# Altium schematic sheet AD8368.SchDoc
size A2; SheetNumber: 1; SheetTotal: 1
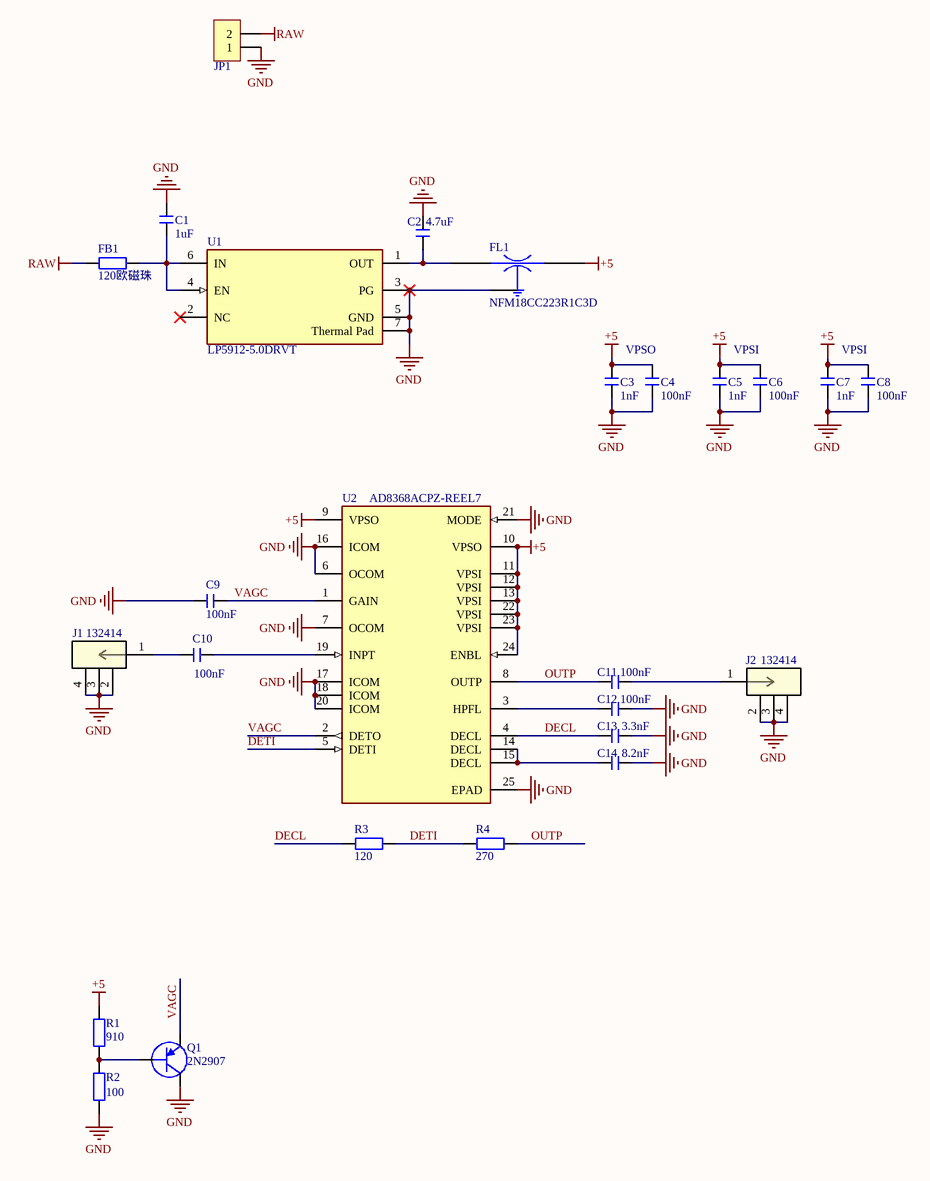
[diagram p0: AD8368.SchDoc]

## Parts
C1  1uF  [C 0603_L]
C2  4.7uF  [C 0603_L]
C3  1nF  [C 0402_L]
C4  100nF  [C 0402_L]
C5  1nF  [C 0402_L]
C6  100nF  [C 0402_L]
C7  1nF  [C 0402_L]
C8  100nF  [C 0402_L]
C9  100nF  [C 0402_L]
C10  100nF  [C 0402_L]
C11  100nF  [C 0402_L]
C12  100nF  [C 0402_L]
C13  3.3nF  [C 0402_L]
C14  8.2nF  [C 0402_L]
FB1  120欧磁珠  [R 0603_L]
FL1  NFM18CC223R1C3D  [FIL_NFM18CC223R1C3D]
J1  132414  [CONN_132414_AMP]
J2  132414  [CONN_132414_AMP]
JP1  HDR-1X2  [KF2510-LI-2P]  (value not drawn)
Q1  2N2907  [SOT23-3N]
R1  910  [R 0402_L]
R2  100  [R 0402_L]
R3  120  [R 0603_L]
R4  270  [R 0603_L]
U1  LP5912-5.0DRVT  [FP-DRV0006A-MFG]
U2  AD8368ACPZ-REEL7  [FP-CP-24-7-IPC_C]

## Nets
+5: C3.2 C4.2 C5.2 C6.2 C7.2 C8.2 FL1.3 R1.2 U2.9(VPSO) U2.10(VPSO) U2.11(VPSI) U2.12(VPSI) U2.13(VPSI) U2.22(VPSI) U2.23(VPSI) U2.24(ENBL)
GND: C1.2 C2.2 C3.1 C4.1 C5.1 C6.1 C7.1 C8.1 C9.1 C12.2 C13.2 C14.2 FL1.2(GND) J1.2 J1.3 J1.4 J2.2 J2.3 J2.4 JP1.1 Q1.3(C) R2.1 U1.3(PG) U1.5(GND) U1.7(Thermal_Pad) U2.6(OCOM) U2.7(OCOM) U2.16(ICOM) U2.17(ICOM) U2.18(ICOM) U2.20(ICOM) U2.21(MODE) U2.25(EPAD)
RAW: FB1.1 JP1.2
DECL: C13.1 R3.1 U2.4(DECL)
DETI: R3.2 R4.1 U2.5(DETI)
OUTP: C11.1 R4.2 U2.8(OUTP)
VAGC: C9.2 Q1.1(E) U2.1(GAIN) U2.2(DETO)
NetC1_1: C1.1 FB1.2 U1.4(EN) U1.6(IN)
NetC2_1: C2.1 FL1.1 U1.1(OUT)
NetC10_1: C10.1 J1.1
NetC10_2: C10.2 U2.19(INPT)
NetC11_2: C11.2 J2.1
NetC12_1: C12.1 U2.3(HPFL)
NetC14_1: C14.1 U2.14(DECL) U2.15(DECL)
NetQ1_2: Q1.2(B) R1.1 R2.2

Not connected (* = marked no-connect by the designer): U1 2(NC)*

## Notes on the sheet
- VPSO
- VPSI

## Library data of the parts
C1-C14 = C: 贴片电容; 淘宝ID: 小糖豆的小窝窝; BOM名称: 贴片电容; 下单链接: https://item.taobao.com/item.htm?ft=t&id=613637044352
FB1 R1-R4 = R: 贴片电阻; 淘宝ID: 小糖豆的小窝窝; BOM名称: 贴片电阻; 下单链接: https://item.taobao.com/item.htm?ft=t&id=613637044352
FL1 = NFM18CC223R1C3D: SMD Capacitor with Capacitance: 22000pF Tol. 20%. Rated Voltage: 16Vdc; MF: Murata; MP: NFM18CC223R1C3D; SnapEDA_Link: https://www.snapeda.com/parts/NFM18CC223R1C3D/Murata/view-part/?ref=snap; Availability: In Stock; Package: NONSTANDARD; Check_prices: https://www.snapeda.com/parts/NFM18CC223R1C3D/Murata/view-part/?ref=eda; Value: *; Purchase-URL: https://pricing.snapeda.com/search/part/NFM18CC223R1C3D/?ref=eda; Price: None
J1 J2 = 132414: No Description Available; Mfr_Name: Amphenol ICC; Copyright: Copyright (C) 2022 Ultra Librarian. All rights reserved.; Manufacturer_Part_Number: 132414; RefDes: RefDes; Type: DEV
JP1 = Header 2: 2P接插件; 淘宝ID: 小糖豆的小窝窝; BOM名称: 2P接插件; 下单链接: https://item.taobao.com/item.htm?ft=t&id=613637044352
Q1 = 2N-PNP: PNP型三极管; BOM名称: NPN型三极管; 淘宝ID: 小糖豆的小窝窝; 下单链接: https://item.taobao.com/item.htm?ft=t&id=613637044352
U1 = LP5912: IC REG LINEAR  5.0V 500MA 6SON; Dropout Voltage: 950mV; Quiescent Current: 30uA; Output Voltage: 3.3V; Number of Regulators: 1; Min Operating Temperature: -40°C; Number of Pins: 6; Max Operating Temperature: 125°C; RoHS Compliant: Yes; Packaging: Tape and Reel; Output Current: 500mA; Mount: Surface Mount; Lead Free: Lead Free
U2 = AD8368ACPZ-REEL7: IC OPAMP VGA 1 CIRCUIT 24LFCSP; Max Frequency: 800MHz; Gain: 34dB; Input Resistance: 50R; Number of Elements: 1; Operating Supply Voltage: 5V; Min Supply Voltage: 4.5V; Power Dissipation: 440mW; Max Supply Voltage: 5.5V; Operating Supply Current: 60mA; Voltage Gain: 22dB; Input Bias Current: 150uA; Package Quantity: 1; Series: X-AMP®; RoHS Compliant: Yes; Case/Package: LFCSP EP; Lead Free: Contains Lead; Number of Pins: 24; Max Operating Temperature: 85°C; Number of Circuits: 1; Mount: Surface Mount; -3db Bandwidth: 800MHz; REACH SVHC: No SVHC; Radiation Hardening: No; Number of Channels: 1; Gain Bandwidth Product: 800MHz; Packaging: Tape and Reel; Min Operating Temperature: -40°C